# Altium project Power_Test.PrjPcb
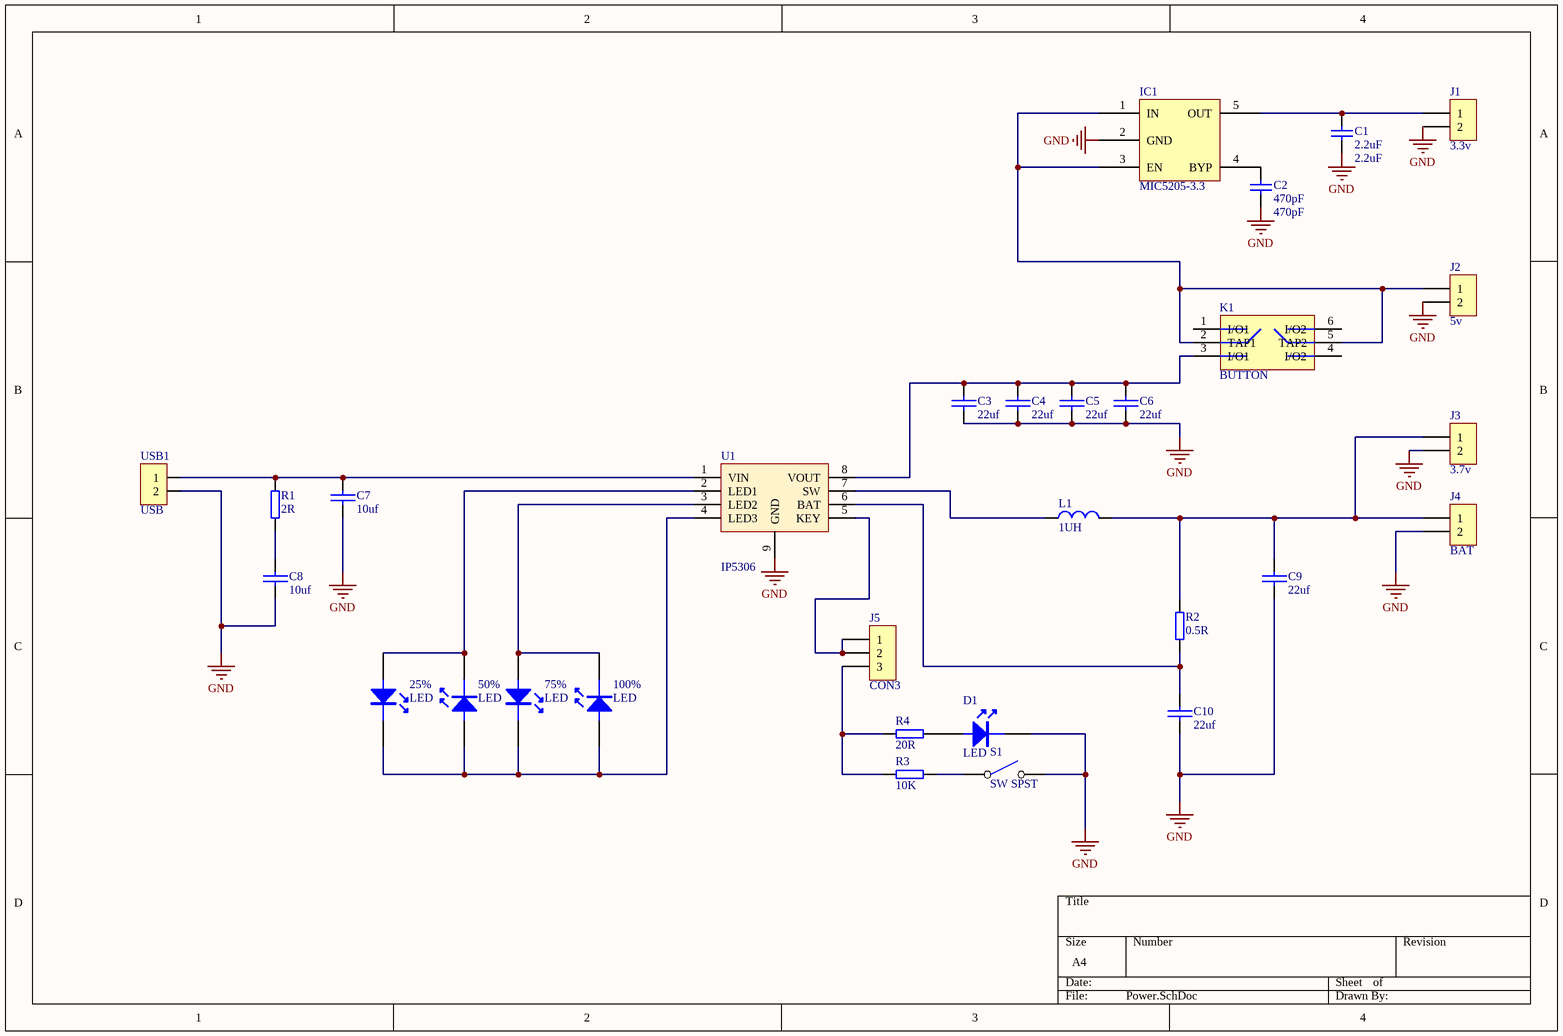
[diagram p0: Power.SchDoc]
1 sheet, 30 parts. Net scope: global (net labels, ports and power ports of the same name join across sheets).
Board file: Power_Test.PcbDoc

## Sheet Power.SchDoc
size A4

### Parts
25%  LED  [6-0805_L]
50%  LED  [6-0805_L]
75%  LED  [6-0805_L]
100%  LED  [6-0805_L]
C1  2.2uF  [6-0805_L]
C2  470pF  [6-0805_L]
C3  22uf  [6-0805_L]
C4  22uf  [6-0805_L]
C5  22uf  [6-0805_L]
C6  22uf  [6-0805_L]
C7  10uf  [6-0805_L]
C8  10uf  [6-0805_L]
C9  22uf  [6-0805_L]
C10  22uf  [6-0805_L]
D1  LED  [6-0805_L]
IC1  MIC5205-3.3  [SOT-23-5]
J1  3.3v  [HDR1X2]
J2  5v  [HDR1X2]
J3  3.7v  [HDR1X2]
J4  BAT  [接线座2P]
J5  CON3  [HDR1X3]
K1  BUTTON  [switch]
L1  1UH  [0630电感]
R1  2R  [6-0805_L]
R2  0.5R  [6-0805_L]
R3  10K  [6-0805_L]
R4  20R  [6-0805_L]
S1  SW SPST  [button]
U1  IP5306  [ESOP8]
USB1  USB  [Type-C]

### Nets
GND: C1.1 C2.1 C3.2 C4.2 C5.2 C6.2 C7.2 C8.2 C9.2 C10.2 D1.K IC1.2(GND) J1.2 J2.2 J3.2 J4.2 S1.2(NO) U1.9(GND) USB1.2
Net25%_A: 25%.A 50%.K U1.2(LED1)
Net25%_K: 25%.K 50%.A 75%.K 100%.A U1.4(LED3)
Net75%_A: 75%.A 100%.K U1.3(LED2)
NetC1_2: C1.2 IC1.5(OUT) J1.1
NetC2_2: C2.2 IC1.4(BYP)
NetC3_1: C3.1 C4.1 C5.1 C6.1 K1.3(I/O1) U1.8(VOUT)
NetC7_1: C7.1 R1.2 U1.1(VIN) USB1.1
NetC8_1: C8.1 R1.1
NetC9_1: C9.1 J3.1 J4.1 L1.2 R2.1
NetC10_1: C10.1 R2.2 U1.6(BAT)
NetD1_A: D1.A R4.1
NetIC1_1: IC1.1(IN) IC1.3(EN) J2.1 K1.2(TAP1) K1.5(TAP2)
NetJ5_1: J5.1 J5.2 U1.5(KEY)
NetJ5_3: J5.3 R3.2 R4.2
NetL1_1: L1.1 U1.7(SW)
NetR3_1: R3.1 S1.1(COMMON)

Not connected (* = marked no-connect by the designer): K1 1(I/O1) 4(I/O2) 6(I/O2)

### Library data of the parts
25% 50% 75% 100% D1 = LED: pin to pad: A>1 K>2
C1 C2 = Cap Semi: Capacitor (Semiconductor SIM Model); Published: 8-Jun-2000; LatestRevisionDate: 29-May-2009; LatestRevisionNote: IPC-7351 Footprint Added.; PackageReference: C1206; Publisher: Altium Limited; PackageDescription: Chip Capacitor
  C1: Value: 2.2uF
  C2: Value: 470pF
C3-C10 = CAP: 电容
IC1 = MIC5205-3.3: 稳压
J1-J4 = CON2: 连接器
J5 = CON3: 连接器
K1 = BUTTON: 自锁按键
L1 = Inductor: 电感
R1-R4 = RES: 电阻
USB1 = CON2: Conjunctor